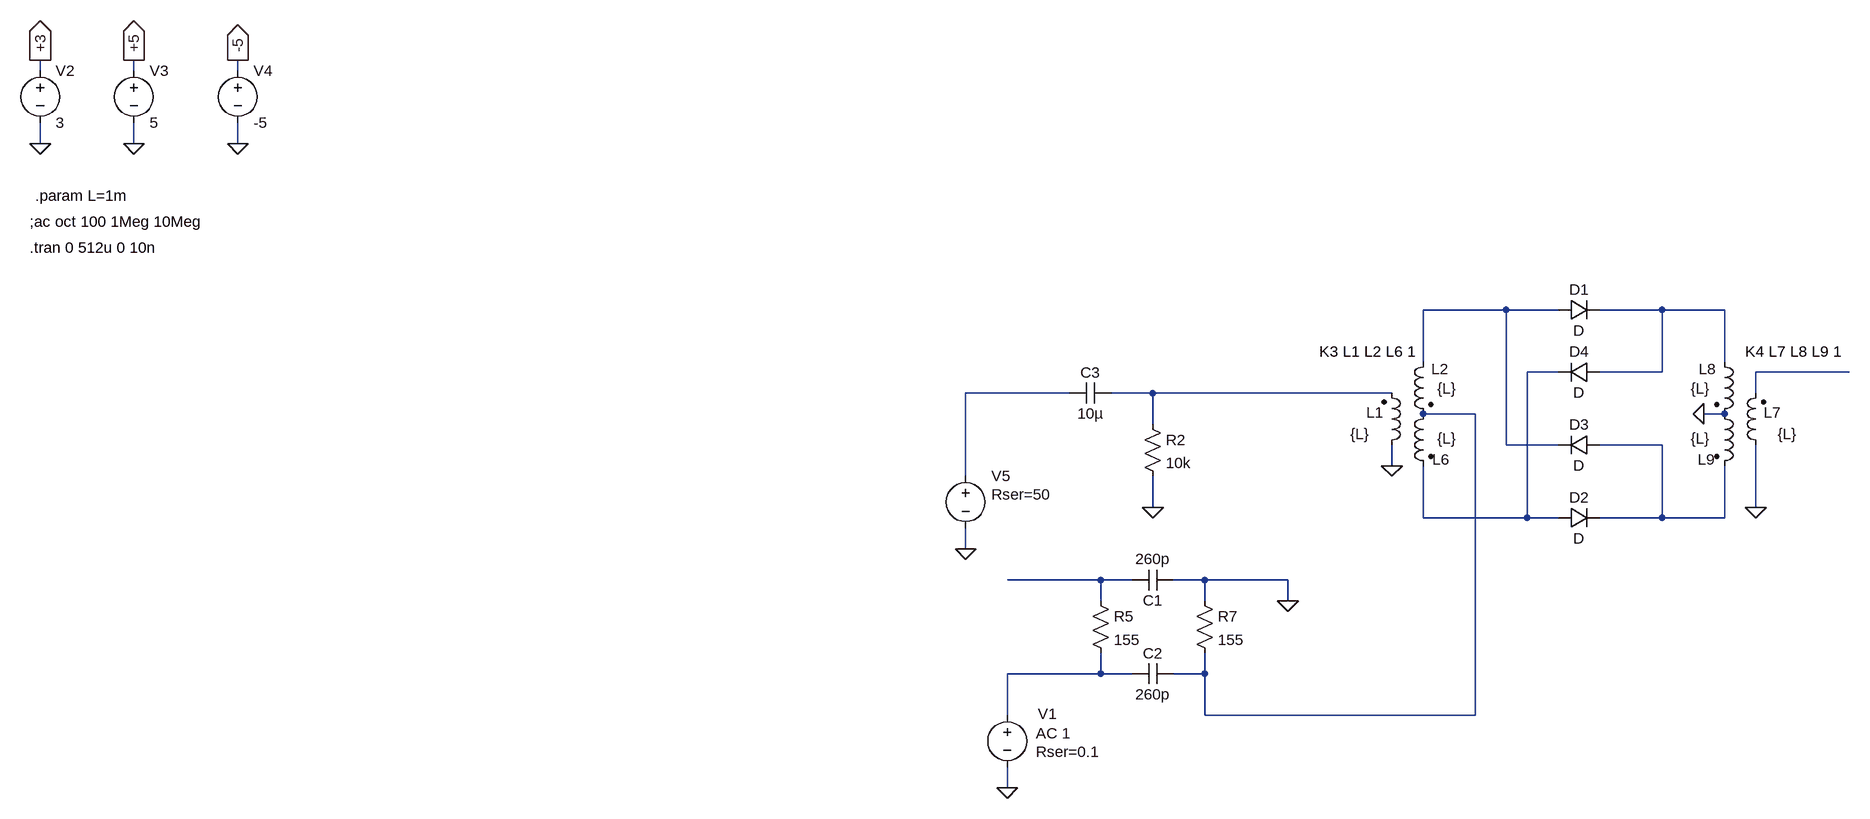
[diagram p0: schematic Analog_Switch.asc]
Analog_Switch.asc, the LTspice schematic file:
Version 4
SHEET 1 1540 896
WIRE -2032 -432 -2032 -448
WIRE -1888 -432 -1888 -448
WIRE -1728 -432 -1728 -448
WIRE -2032 -320 -2032 -352
WIRE -1888 -320 -1888 -352
WIRE -1728 -320 -1728 -352
WIRE 224 -64 96 -64
WIRE 304 -64 224 -64
WIRE 464 -64 368 -64
WIRE 560 -64 464 -64
WIRE 96 16 96 -64
WIRE 560 16 560 -64
WIRE 304 32 256 32
WIRE 464 32 464 -64
WIRE 464 32 368 32
WIRE 752 32 608 32
WIRE -448 64 -608 64
WIRE -320 64 -384 64
WIRE 48 64 -320 64
WIRE 608 64 608 32
WIRE 176 96 96 96
WIRE 560 96 528 96
WIRE -320 112 -320 64
WIRE 224 144 224 -64
WIRE 304 144 224 144
WIRE 464 144 368 144
WIRE 48 176 48 144
WIRE -608 192 -608 64
WIRE -320 240 -320 192
WIRE 608 240 608 144
WIRE 96 256 96 176
WIRE 256 256 256 32
WIRE 256 256 96 256
WIRE 304 256 256 256
WIRE 464 256 464 144
WIRE 464 256 368 256
WIRE 560 256 560 176
WIRE 560 256 464 256
WIRE -608 304 -608 272
WIRE -400 352 -544 352
WIRE -352 352 -400 352
WIRE -240 352 -288 352
WIRE -112 352 -240 352
WIRE -400 384 -400 352
WIRE -240 384 -240 352
WIRE -112 384 -112 352
WIRE -400 496 -400 464
WIRE -400 496 -544 496
WIRE -352 496 -400 496
WIRE -240 496 -240 464
WIRE -240 496 -288 496
WIRE -544 560 -544 496
WIRE -240 560 -240 496
WIRE 176 560 176 96
WIRE 176 560 -240 560
WIRE -544 672 -544 640
FLAG -1888 -320 0
FLAG -1728 -320 0
FLAG -1888 -448 +5
IOPIN -1888 -448 Out
FLAG -1728 -448 -5
IOPIN -1728 -448 Out
FLAG -544 672 0
FLAG -608 304 0
FLAG -112 384 0
FLAG -2032 -320 0
FLAG -2032 -448 +3
IOPIN -2032 -448 Out
FLAG 608 240 0
FLAG 528 96 0
FLAG 48 176 0
FLAG -320 240 0
SYMBOL voltage -544 544 R0
WINDOW 0 47 14 Left 2
WINDOW 3 24 96 Invisible 2
WINDOW 123 44 44 Left 2
WINDOW 39 44 72 Left 2
SYMATTR InstName V1
SYMATTR Value SINE(0 700m 4.433618Meg 0 0 0)
SYMATTR Value2 AC 1
SYMATTR SpiceLine Rser=0.1
SYMBOL voltage -1888 -448 R0
WINDOW 123 0 0 Left 0
WINDOW 39 0 0 Left 0
SYMATTR InstName V3
SYMATTR Value 5
SYMBOL voltage -1728 -448 R0
WINDOW 123 0 0 Left 0
WINDOW 39 0 0 Left 0
SYMATTR InstName V4
SYMATTR Value -5
SYMBOL voltage -608 176 R0
WINDOW 3 24 96 Invisible 2
WINDOW 123 0 0 Left 0
WINDOW 39 40 44 Left 2
WINDOW 0 40 16 Left 2
SYMATTR Value PULSE(0 5 0 0.1u 0.1u 64u 128u)
SYMATTR SpiceLine Rser=50
SYMATTR InstName V5
SYMBOL cap -288 336 R90
WINDOW 0 63 32 VBottom 2
WINDOW 3 -32 32 VTop 2
SYMATTR InstName C1
SYMATTR Value 260p
SYMBOL cap -288 480 R90
WINDOW 0 0 32 VBottom 2
WINDOW 3 32 32 VTop 2
SYMATTR InstName C2
SYMATTR Value 260p
SYMBOL voltage -2032 -448 R0
WINDOW 123 0 0 Left 0
WINDOW 39 0 0 Left 0
SYMATTR InstName V2
SYMATTR Value 3
SYMBOL res -416 368 R0
SYMATTR InstName R5
SYMATTR Value 155
SYMBOL res -256 368 R0
SYMATTR InstName R7
SYMATTR Value 155
SYMBOL ind2 32 160 M180
WINDOW 0 -23 66 Left 2
WINDOW 3 -48 33 Left 2
SYMATTR InstName L1
SYMATTR Value {L}
SYMATTR Type ind
SYMATTR SpiceLine Ipk=0.35 Rser=0.15 Rpar=0 Cpar=0
SYMBOL ind2 112 0 M0
WINDOW 0 -24 27 Left 2
WINDOW 3 -36 57 Left 2
SYMATTR InstName L2
SYMATTR Value {L}
SYMATTR Type ind
SYMATTR SpiceLine Ipk=0.35 Rser=0.15 Rpar=0 Cpar=0
SYMBOL ind2 112 80 M0
WINDOW 0 -25 86 Left 2
WINDOW 3 -36 54 Left 2
SYMATTR InstName L6
SYMATTR Value {L}
SYMATTR Type ind
SYMATTR SpiceLine Ipk=0.35 Rser=0.15
SYMBOL diode 304 -48 R270
WINDOW 0 32 32 VTop 2
WINDOW 3 0 32 VBottom 2
SYMATTR InstName D1
SYMBOL diode 304 272 R270
WINDOW 0 32 32 VTop 2
WINDOW 3 0 32 VBottom 2
SYMATTR InstName D2
SYMBOL ind2 624 160 R180
WINDOW 0 -23 66 Left 2
WINDOW 3 -48 33 Left 2
SYMATTR InstName L7
SYMATTR Value {L}
SYMATTR Type ind
SYMATTR SpiceLine Ipk=0.35 Rser=0.15 Rpar=0 Cpar=0
SYMBOL ind2 544 0 R0
WINDOW 0 -24 27 Left 2
WINDOW 3 -36 57 Left 2
SYMATTR InstName L8
SYMATTR Value {L}
SYMATTR Type ind
SYMATTR SpiceLine Ipk=0.35 Rser=0.15 Rpar=0 Cpar=0
SYMBOL ind2 544 80 R0
WINDOW 0 -25 86 Left 2
WINDOW 3 -36 54 Left 2
SYMATTR InstName L9
SYMATTR Value {L}
SYMATTR Type ind
SYMATTR SpiceLine Ipk=0.35 Rser=0.15 Rpar=0 Cpar=0
SYMBOL diode 368 128 R90
WINDOW 0 0 32 VBottom 2
WINDOW 3 32 32 VTop 2
SYMATTR InstName D3
SYMBOL diode 368 16 R90
WINDOW 0 0 32 VBottom 2
WINDOW 3 32 32 VTop 2
SYMATTR InstName D4
SYMBOL cap -384 48 R90
WINDOW 0 0 32 VBottom 2
WINDOW 3 32 32 VTop 2
SYMATTR InstName C3
SYMATTR Value 10µ
SYMBOL res -336 96 R0
SYMATTR InstName R2
SYMATTR Value 10k
TEXT -2048 -160 Left 2 !.tran 0 512u 0 10n
TEXT -2048 -200 Left 2 !;ac oct 100 1Meg 10Meg
TEXT -64 0 Left 2 !K3 L1 L2 L6 1
TEXT 592 0 Left 2 !K4 L7 L8 L9 1
TEXT -2040 -240 Left 2 !.param L=1m

The netlist it stands for:
* Analog_Switch.asc
V1 N010 0 SINE(0 700m 4.433618Meg 0 0 0) AC 1 Rser=0.1
V3 +5 0 5
V4 -5 0 -5
V5 N005 0 PULSE(0 5 0 0.1u 0.1u 64u 128u) Rser=50
C1 0 N009 260p
C2 N007 N010 260p
V2 +3 0 3
R5 N009 N010 155
R7 0 N007 155
L1 0 N006 {L} Ipk=0.35 Rser=0.15 Rpar=0 Cpar=0
L2 N001 N007 {L} Ipk=0.35 Rser=0.15 Rpar=0 Cpar=0
L6 N007 N003 {L} Ipk=0.35 Rser=0.15
D1 N001 N002 D
D2 N003 N008 D
L7 0 N004 {L} Ipk=0.35 Rser=0.15 Rpar=0 Cpar=0
L8 N002 0 {L} Ipk=0.35 Rser=0.15 Rpar=0 Cpar=0
L9 0 N008 {L} Ipk=0.35 Rser=0.15 Rpar=0 Cpar=0
D3 N008 N001 D
D4 N002 N003 D
C3 N006 N005 10µ
R2 N006 0 10k
.model D D
.lib standard.dio
.tran 0 512u 0 10n
;ac oct 100 1Meg 10Meg
K3 L1 L2 L6 1
K4 L7 L8 L9 1
.param L=1m
.backanno
.end